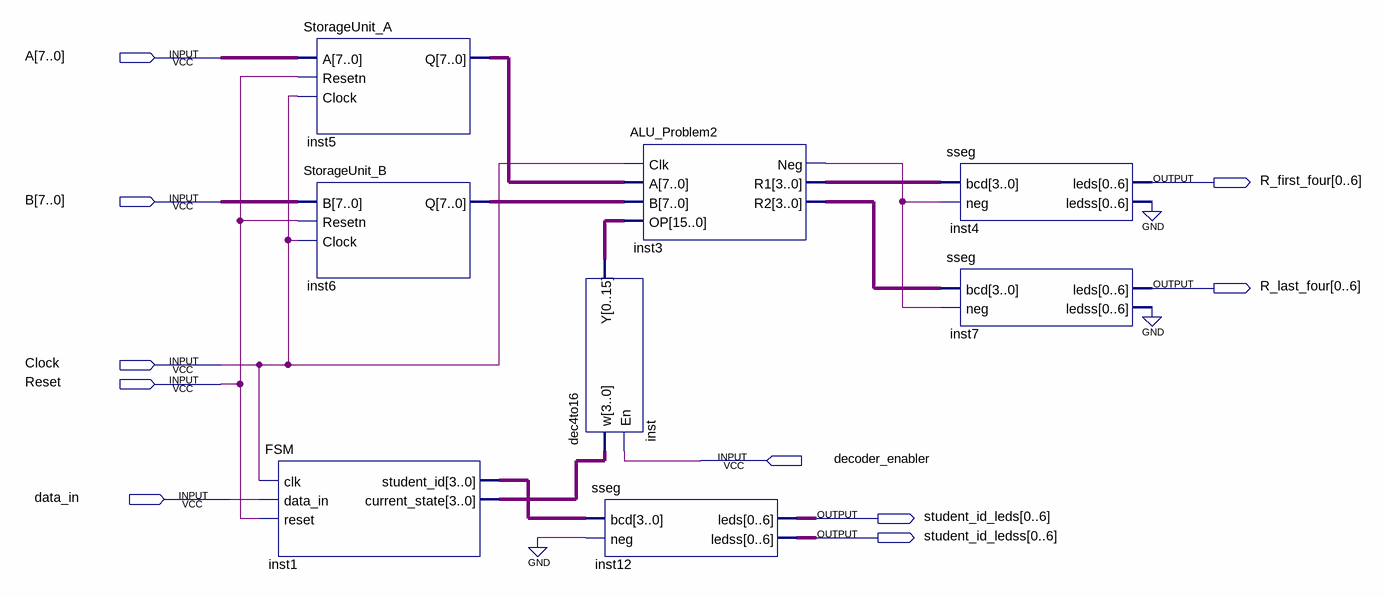
[diagram p0: schematic sheet]
// Quartus schematic Lab6_problem2.bdf as structural Verilog: 8 symbols, 10 pins
module Lab6_problem2 (
  input  [7:0] A,
  input  [7:0] B,
  input  Clock,
  input  Reset,
  input  decoder_enabler,
  input  data_in,
  output [0:6] R_first_four,
  output [0:6] R_last_four,
  output [0:6] student_id_leds,
  output [0:6] student_id_ledss
);

  wire inst3_neg;
  wire [3:0] inst1_current_state, inst1_student_id, inst3_r1, inst3_r2;
  wire [6:0] inst4_ledss, inst7_ledss;
  wire [7:0] inst5_q, inst6_q;
  wire [15:0] inst_y;

  StorageUnit_A inst5 (.A(A), .Resetn(Reset), .Clock(Clock), .Q(inst5_q));
  StorageUnit_B inst6 (.B(B), .Resetn(Reset), .Clock(Clock), .Q(inst6_q));
  FSM inst1 (
    .clk(Clock), .data_in(data_in), .reset(Reset), .student_id(inst1_student_id),
    .current_state(inst1_current_state));
  ALU_Problem2 inst3 (
    .Clk(Clock), .A(inst5_q), .B(inst6_q), .OP(inst_y), .Neg(inst3_neg), .R1(inst3_r1), .R2(inst3_r2));
  dec4to16 inst (.w(inst1_current_state), .En(decoder_enabler), .Y(inst_y));
  sseg inst12 (.bcd(inst1_student_id), .neg(1'b0), .leds(student_id_leds), .ledss(student_id_ledss));
  sseg inst4 (.bcd(inst3_r1), .neg(inst3_neg), .leds(R_first_four), .ledss(inst4_ledss));
  sseg inst7 (.bcd(inst3_r2), .neg(inst3_neg), .leds(R_last_four), .ledss(inst7_ledss));
  // also tied to GND on the sheet: {inst4_ledss[0], inst4_ledss[1], inst4_ledss[2], inst4_ledss[3], inst4_ledss[4], inst4_ledss[5], inst4_ledss[6], inst7_ledss[0], inst7_ledss[1], inst7_ledss[2], inst7_ledss[3], inst7_ledss[4], inst7_ledss[5], inst7_ledss[6]}
endmodule
